# Altium schematic sheet Copy of Connectors.SchDoc: Connectors
size A3; Date: Not used; ApprovedBy: Not used; CheckedBy: Not used; Author: Not used; CompanyName: STMicroelectronics; DrawnBy: Not used; Engineer: Not used; Organization: Not used; Address1: Not used; Address2: Not used; Address3: Not used; Address4: Not used; DocumentNumber: 5; Revision: Not used; SheetNumber: 5; SheetTotal: 9; CurrentTime: Not used; CurrentDate: Not used; Time: Not used; DocumentFullPathAndName: Not used; DocumentName: Not used; ModifiedDate: Not used; ImagePath: Not used; ProjectName: Not used; Application_BuildNumber: Not used
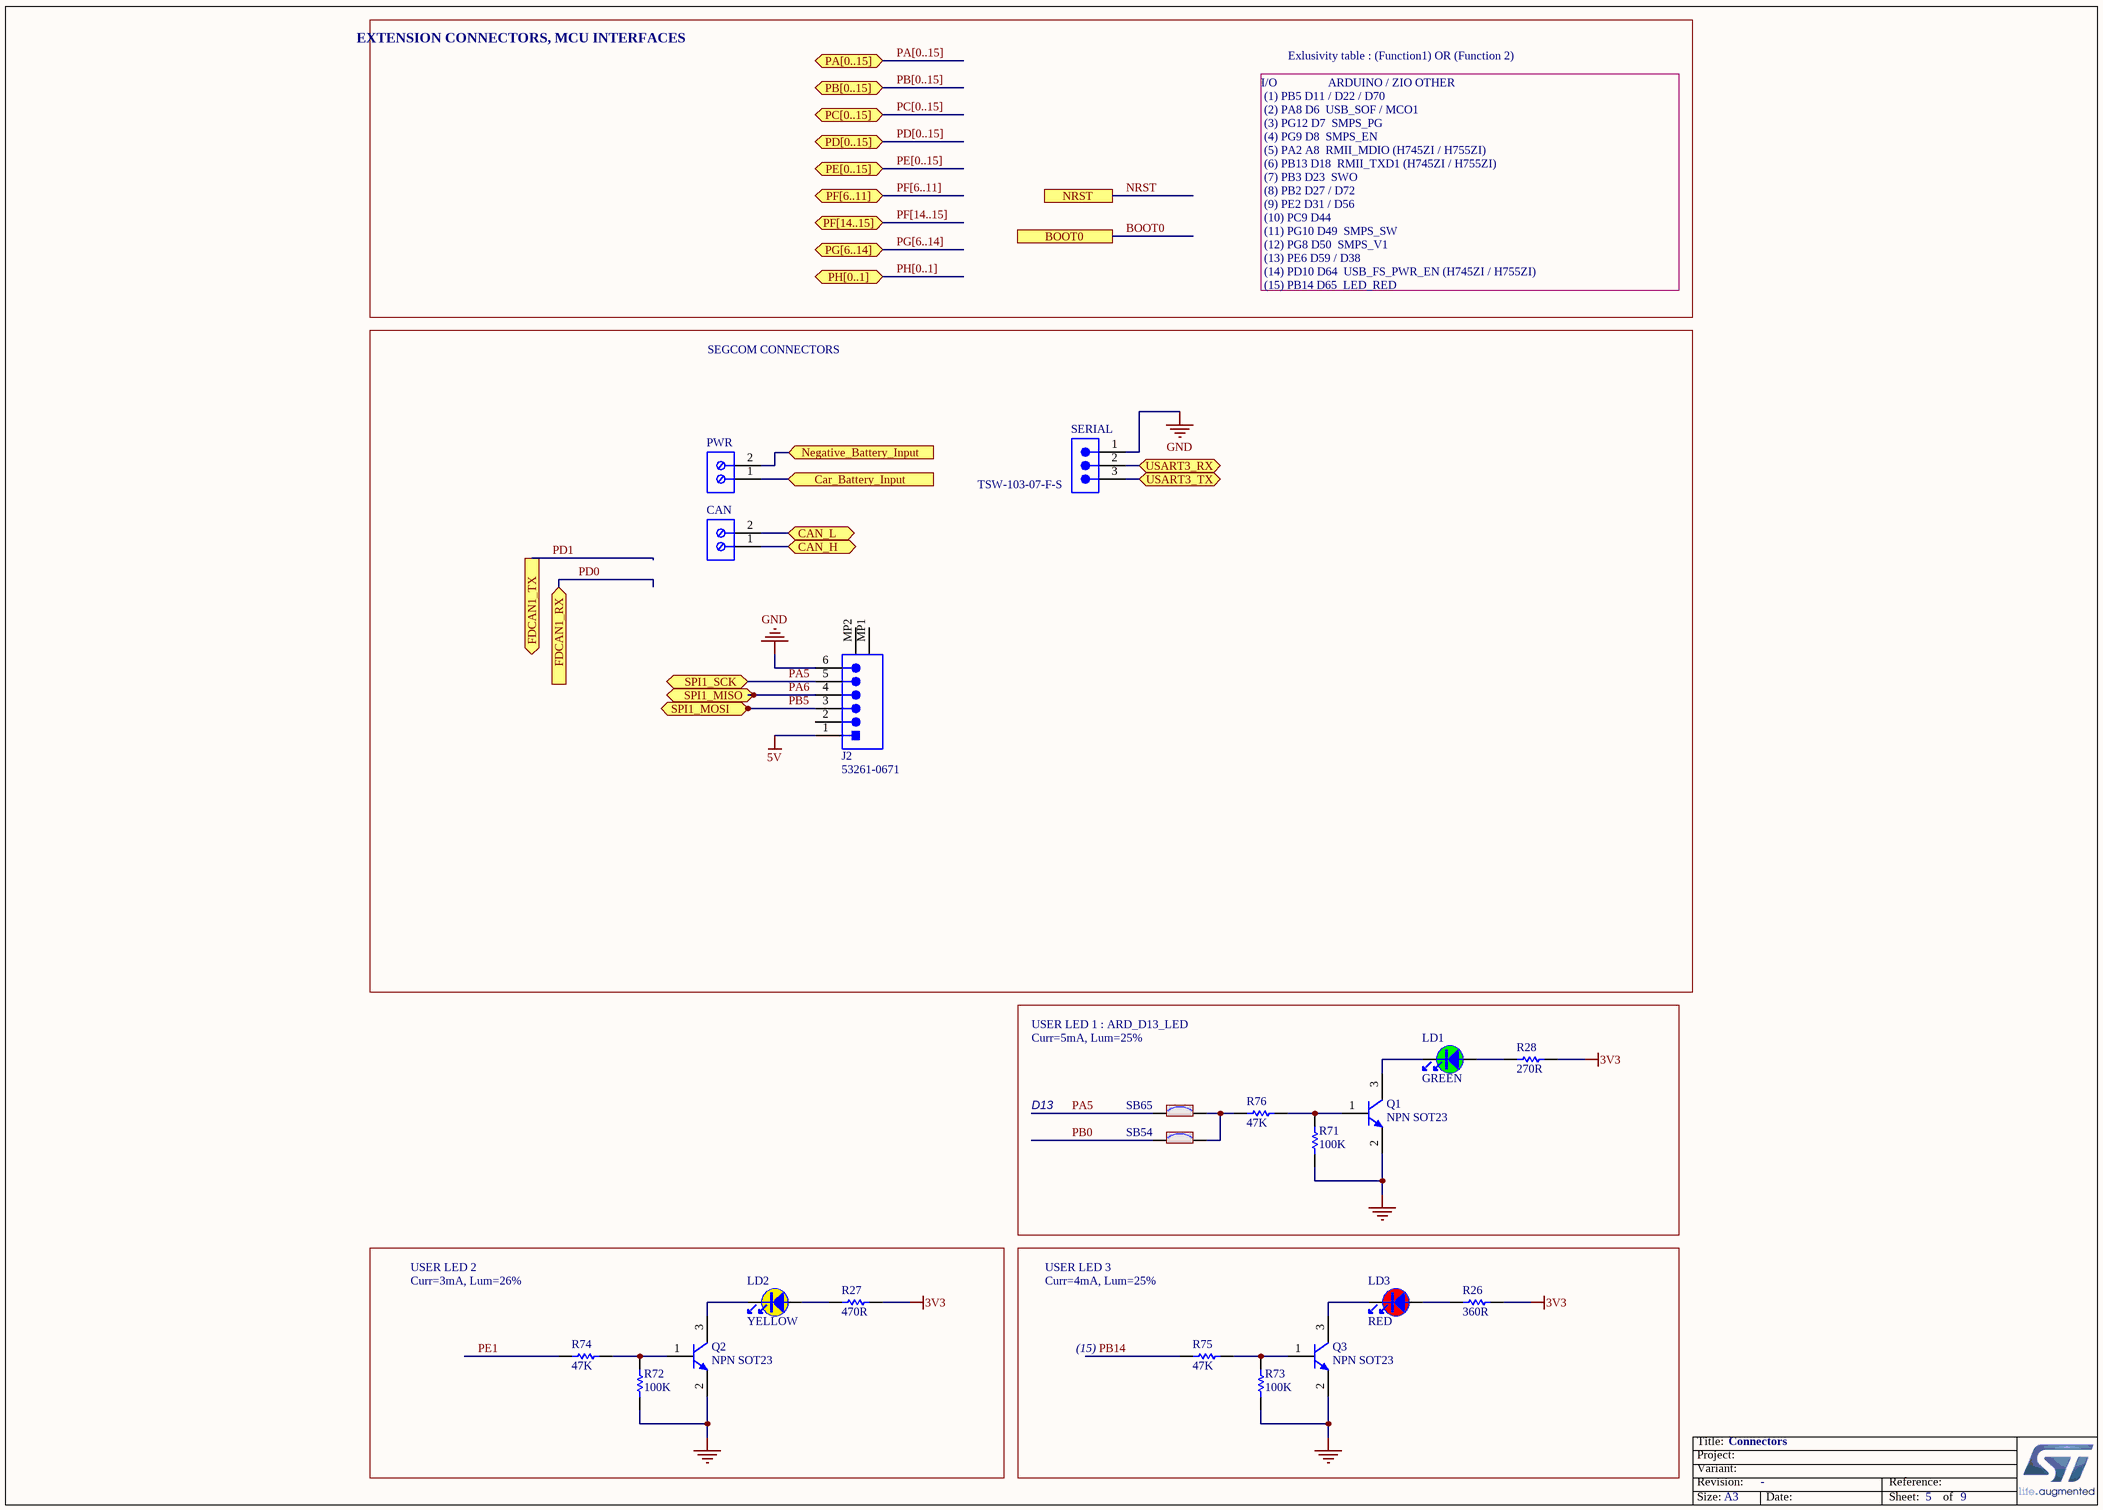
[diagram p0: Copy of Connectors.SchDoc]

## Parts
CAN  (no value)  [TECO-282836-2_V]
J2  53261-0671  [53261-0671]
LD1  value GREEN  [LED_0603_OSRAM_LG-Q396-PS-35_GREEN_1A2K_H0P4]  (hidden comment: LED_green)
LD2  value YELLOW  [LED_0603_OSRAM_LY-Q396-P1Q2-36_YELLOW_1A2K_H0P4]  (hidden comment: LED_yellow)
LD3  value RED  [LED_0603_OSRAM_LS-Q976-NR-1_RED_1A2K_H0P8]  (hidden comment: LED_red)
PWR  (no value)  [TECO-282836-2_V]
Q1  value NPN SOT23  [NPN_SOT23]  (hidden comment: 9013-SOT23)
Q2  value NPN SOT23  [NPN_SOT23]  (hidden comment: 9013-SOT23)
Q3  value NPN SOT23  [NPN_SOT23]  (hidden comment: 9013-SOT23)
R26  value 360R  [R0603]  (hidden comment: Resistor)
R27  value 470R  [R0603]  (hidden comment: Resistor)
R28  value 270R  [R0402]  (hidden comment: Resistor)
R71  value 100K  [R0603]  (hidden comment: Resistor)
R72  value 100K  [R0603]  (hidden comment: Resistor)
R73  value 100K  [R0603]  (hidden comment: Resistor)
R74  value 47K  [R0603]  (hidden comment: Resistor)
R75  value 47K  [R0603]  (hidden comment: Resistor)
R76  value 47K  [R0603]  (hidden comment: Resistor)
SB54  SB_ON  [SOLDER-BRIDGE_R0603-0R]  (value not drawn)
SB65  SB_ON  [SOLDER-BRIDGE_R0603-0R]  (value not drawn)
SERIAL  TSW-103-07-F-S  [SMTC-TSW-103-07-X-S]

## Blocks framed on the sheet
SEGCOM CONNECTORS: CAN J2 PWR SERIAL

## Ports
BOOT0, CAN_H (bidir), CAN_L (bidir), Car_Battery_Input (in), FDCAN1_RX (in), FDCAN1_TX (out), Negative_Battery_Input (in), NRST, PA[0..15] (bidir), PB[0..15] (bidir), PC[0..15] (bidir), PD[0..15] (bidir), PE[0..15] (bidir), PF[6..11] (bidir), PF[14..15] (bidir), PG[6..14] (bidir), PH[0..1] (bidir), SPI1_MISO (bidir), SPI1_MOSI (bidir), SPI1_SCK (bidir), USART3_RX (bidir), USART3_TX (bidir)

## Nets
3V3: R26.2 R27.2 R28.2
5V: J2.1
GND: J2.6 Q1.2(E) Q2.2(E) Q3.2(E) R71.1 R72.1 R73.1 SERIAL.1
BOOT0: port BOOT0
CAN_H: CAN.1 ; port CAN_H
CAN_L: CAN.2 ; port CAN_L
Car_Battery_Input: PWR.1 ; port Car_Battery_Input
Negative_Battery_Input: PWR.2 ; port Negative_Battery_Input
NRST: port NRST
PA5: J2.5 SB65.1 ; port SPI1_SCK
PA6: J2.4 ; port SPI1_MISO
PB0: SB54.1
PB5: J2.3 ; port SPI1_MOSI
PB14: R75.1
PD0: port FDCAN1_RX
PD1: port FDCAN1_TX
PE1: R74.1
USART3_RX: SERIAL.2 ; port USART3_RX
USART3_TX: SERIAL.3 ; port USART3_TX
NetLD1_1: LD1.1 R28.1
NetLD1_2: LD1.2 Q1.3(C)
NetLD2_1: LD2.1 R27.1
NetLD2_2: LD2.2 Q2.3(C)
NetLD3_1: LD3.1 R26.1
NetLD3_2: LD3.2 Q3.3(C)
NetQ1_1: Q1.1(B) R71.2 R76.2
NetQ2_1: Q2.1(B) R72.2 R74.2
NetQ3_1: Q3.1(B) R73.2 R75.2
NetR76_1: R76.1 SB54.2 SB65.2

Not connected (* = marked no-connect by the designer): J2 2 MP1 MP2

## Buses and harness runs
bus PA[0..15] = port PA[0..15]
bus PB[0..15] = port PB[0..15]
bus PC[0..15] = port PC[0..15]
bus PD[0..15] = port PD[0..15]
bus PE[0..15] = port PE[0..15]
bus PF[6..11] = port PF[6..11]
bus PF[14..15] = port PF[14..15]
bus PG[6..14] = port PG[6..14]
bus PH[0..1] = port PH[0..1]

## Notes on the sheet
- EXTENSION CONNECTORS, MCU INTERFACES
- Exlusivity table : (Function1) OR (Function 2)
- I/O	                ARDUINO / ZIO	OTHER
  (1)	PB5	D11 / D22 / D70
  (2)	PA8	D6		USB_SOF / MCO1
  (3)	PG12	D7		SMPS_PG
  (4)	PG9	D8		SMPS_EN
  (5)	PA2	A8		RMII_MDIO (H745ZI / H755ZI)
  (6)	PB13	D18		RMII_TXD1 (H745ZI / H755ZI)
  (7)	PB3	D23		SWO
  (8)	PB2	D27 / D72
  (9)	PE2	D31 / D56
  (10)	PC9	D44
  (11)	PG10	D49		SMPS_SW
  (12)	PG8	D50		SMPS_V1
  (13)	PE6	D59 / D38
  (14)	PD10	D64		USB_FS_PWR_EN (H745ZI / H755ZI)
  (15)	PB14	D65		LED_RED
- USER LED 1 : ARD_D13_LED
- Curr=5mA, Lum=25%
- D13
- USER LED 2
- Curr=3mA, Lum=26%
- USER LED 3
- Curr=4mA, Lum=25%
- (15)
- Title:
- Project:
- Size:
- Revision:
- Variant:
- A3
- -
- Date:
- Reference:
- Sheet:
- of

## Library data of the parts
CAN PWR = CMP-1684-00017-1: Female Header, Pitch 5 mm, 1 x 2 Position, Height 10 mm, Tail Length 3.5 mm, Rohs, Bulk; Manufacturer: TE Connectivity; Wire Gauge: 16-30AWG; Product Training Modules: Wire-to-BoardEurostyleTerminalBlocks; Clamp Material - Plating: Brass-NickelPlated; Voltage: 300V; Mating Orientation: HorizontalwithBoard; Current: 13.5A; Pitch: 0.197"(5.00mm); Screw Thread: M3; 3D Model: 282836-2.pdf; Other Names: 5ULV-02B / A98076; Dynamic Catalog: BuchananSeries; Number of Levels: 1; Torque - Screw: 0.68Nm(6Lb-In); Featured Product: EurostyleTerminalBlockConnectors; Positions Per Level: 2; Wire Termination: Screw-RisingCageClamp; Datasheet URL: http://www.te.com.cn/commerce/DocumentDelivery/DDEController?Action=showdoc&DocId=Catalog+Section%7F1308389_EUROSTYLE_TERMINAL_BLOCKS%7F0607%7Fpdf%7FEnglish%7FENG_CS_1308389_EUROSTYLE_TERMINAL_BLOCKS_0607.pdf%7F282836-2; Color: Green; Family: TerminalBlocks-WiretoBoard; RoHS Information: 282836-2StatementofCompliance; Standard Package: 300; Contact Material - Plating: Brass-TinPlated; Manufacturer URL: http://www.te.com; Housing Material: Polyamide(PA66),Nylon6/6; Features: Interlocking(Side); Package Description: Female Header, Pitch 5 mm, 1 x 2 Position, Height 10 mm, Tail Length 3.5 mm; Mounting Type: ThroughHole; Package Reference: THD; Packaging: Bulk; Series: Buchanan; Category: Connectors,Interconnects; Screw Material - Plating: Brass-NickelPlated
J2 = CMP-002-00079-1: 1.25mm (.049") Pitch PicoBlade Header, Surface Mount, Right Angle, Lead-free, 6 Circuits; Manufacturer Series: 53261; Manufacturer: Molex; Filter Feature: No; Number of Positions: 6; Voltage Rating (DC): 125V; Body Plating: Tin; Number of Rows Loaded: 1; Gender: Male; Glow Wire Compliant: Non-compliant; Insulation Resistance: 100MR; Current Rating: 1A; Option: General Purpose; ComponentLink6Description: https://datasheet.ciiva.com/9468/0532610671-pcb-headers-9468508.pdf?src-supplier=Avnet; Number of Circuits: 6; Termination: SMD/SMT; Source: Board.SCHLIB; Number of Contacts: 6; ComponentLink3URL: https://datasheet.ciiva.com/11746/0900766b8078fc7f-11746609.pdf?src-supplier=Rs; Pricing 1: 1=0,58, 10=0,502, 50=0,502, 100=0,467, 1000=0,437, 10000=0,375 (USD); RoHS: Yes; Lead Free: Lead Free; Max Operating Temperature: 85°C; Design Item ID: 53261-0671; ComponentLink7URL: https://datasheet.ciiva.com/14156/gh116861-116874-e-14156230.pdf?src-supplier=Distrelec; Reach SVHC Compliant: Unknown; ComponentLink5URL: https://datasheet.ciiva.com/34302/1302107-34302178.pdf?src-supplier=Jameco; Flammability Rating: UL94 V-0; Plating: Tin; Pitch: 1.25mm; Contact Material: Bronze,Brass,Tin; ComponentLink2Description: https://datasheet.ciiva.com/30206/347800532610671-pcb-headers-30206472.pdf?src-supplier=Onlinecomponents.com; Voltage Rating: 125V; Mixed Contacts: No; Working Voltage: 125V; ComponentLink4URL: https://datasheet.ciiva.com/22703/1839670-22703170.pdf?src-supplier=Element14; ComponentLink1URL: https://datasheet.ciiva.com/5153/0532610671-pcb-headers-170915-5153227.pdf?src-supplier=Mouser; Category: Headers and Wire Housings; ComponentLink5Description: https://datasheet.ciiva.com/34302/1302107-34302178.pdf?src-supplier=Jameco; Manufacturer Part Number: 53261-0671; Color: Beige; Voltage Rating (AC): 125V; Lead Pitch: 1.25mm; DIN Conformance: No; Number of Rows: 1; Package Quantity: 1000; ComponentLink7Description: https://datasheet.ciiva.com/14156/gh116861-116874-e-14156230.pdf?src-supplier=Distrelec; Series: PicoBlade; RoHS Compliant: Yes; Mounting Style: STRAIGHT; Contact Plating: Tin; Min Operating Temperature: -40°C; Orientation: Right Angle; Packaging: Tape and Reel; ComponentLink2URL: https://datasheet.ciiva.com/30206/347800532610671-pcb-headers-30206472.pdf?src-supplier=Onlinecomponents.com; Mounting Technology: Board; ComponentLink3Description: https://datasheet.ciiva.com/11746/0900766b8078fc7f-11746609.pdf?src-supplier=Rs; ComponentLink4Description: https://datasheet.ciiva.com/22703/1839670-22703170.pdf?src-supplier=Element14; Stock 1: 44828; Contact Gender: Male; ComponentLink6URL: https://datasheet.ciiva.com/9468/0532610671-pcb-headers-9468508.pdf?src-supplier=Avnet; IEC Conformance: No; ComponentLink1Description: https://datasheet.ciiva.com/5153/0532610671-pcb-headers-170915-5153227.pdf?src-supplier=Mouser; Housing Material: Thermoplastic; Radiation Hardening: No; MIL Conformance: No
LD1 = MCD-00588: LED Green, 0603 SMD, Forward Voltage Typ=2V, Max=2.5V; Part_Type: Display; Manufacturer_Part_Number: LG Q396-PS-35; Manufacturer: OSRAM OPTO SEMICONDUCTORS; Alternate_Manufacturer_Part_Number: VLMTG1300-GS08; Alternate_Manufacturer: VISHAY SEMICONDUCTOR OPTO DIVISION; Provided_By: SUBCO; Internal_Part_Number: MCD-00588; Status: Released; Package: LED 0603; ComponentLink1Description: Datasheet; ComponentLink1URL: http://tunmcdsvn.tun.st.com/Component_Datasheet_Library/Trunk/Display/OSRAM_LED_GREEN_LG Q396-PS-35; Order_Code_Digikey: LG Q396-PS-35-ND; ECCN_US: n/a; ECCN_EU: n/a
LD2 = MCD-01061: LED Yellow, 0603 SMD, Forward Voltage min=1.7V, Typ=2V, Max=2.3V; Part_Type: Display; Manufacturer_Part_Number: LY Q396-P1Q2-36; Manufacturer: OSRAM OPTO SEMICONDUCTORS; Provided_By: SUBCO; Internal_Part_Number: MCD-01061; Status: Released; ComponentLink1Description: Datasheet; ComponentLink1URL: http://tunmcdsvn.tun.st.com/Component_Datasheet_Library/Trunk/Display/OSRAM_LED_0603_YELLOW_LY Q396-P1Q2-36; ECCN_US: n/a; ECCN_EU: n/a
LD3 = MCD-00586: LED Red, 0603 SMD, Forward Voltage Typ=2V, Max=2.5V; Part_Type: Display; Manufacturer_Part_Number: LS Q976-NR-1; Manufacturer: OSRAM OPTO SEMICONDUCTORS; Alternate_Manufacturer_Part_Number: VLMS1300-GS08; Alternate_Manufacturer: VISHAY SEMICONDUCTOR OPTO DIVISION; Provided_By: SUBCO; Internal_Part_Number: MCD-00586; Status: Released; Package: LED 0603; ComponentLink1Description: Datasheet; ComponentLink1URL: http://tunmcdsvn.tun.st.com/Component_Datasheet_Library/Trunk/Display/OSRAM_LED_RED_LS Q976-NR-1; Order_Code_Digikey: 475-2512-1-ND; ECCN_US: n/a; ECCN_EU: n/a
Q1-Q3 = MCD-00073: NPN Bipolar Transistor; Part_Type: IC; Manufacturer_Part_Number: BSR14; Manufacturer: ON SEMICONDUCTOR; Alternate_Manufacturer_Part_Number: MMBT2222LT1G / MMBT2222ALT1G / MMBT2222ALT3G; Provided_By: SUBCO; ECCN_US: EAR99; ECCN_EU: NEC; Revision: *; Internal_Part_Number: MCD-00073; Status: Released; ComponentLink1Description: Datasheet; ComponentLink1URL: http://tunmcdsvn.tun.st.com/Component_Datasheet_Library/Trunk/IC/NXP_Transistor_BSR14; Alternate_Manufacturer: ON SEMICONDUCTOR; Package: SOT23
R26 = MCD-00462: Resistor,360R,0603,1%,1/10W; Manufacturer_Part_Number: RC0603FR-07360RL; Manufacturer: YAGEO; BMS_Part_Number: 9129744; Provided_By: SUBCO; ECCN_US: EAR99; ECCN_EU: NEC; Internal_Part_Number: MCD-00462; Status: Released; Part_Type: Resistor; Package: R0603; ComponentLink1Description: Datasheet; ComponentLink1URL: http://tunmcdsvn.tun.st.com/Component_Datasheet_Library/Trunk/Resistors/Yageo_Resistor_RC0603-series
R27 = MCD-00354: Resistor,470R,0603,1%,1/10W; Manufacturer_Part_Number: RC0603FR-07470RL; Manufacturer: YAGEO; BMS_Part_Number: 9129906; Provided_By: SUBCO; ECCN_US: EAR99; ECCN_EU: NEC; Internal_Part_Number: MCD-00354; Status: Released; Part_Type: Resistor; Package: R0603; ComponentLink1Description: Datasheet; ComponentLink1URL: http://tunmcdsvn.tun.st.com/Component_Datasheet_Library/Trunk/Resistors/Yageo_Resistor_RC0603-series
R28 = MCD-00441: Resistor,270R,0402,1%,1/16W; Manufacturer_Part_Number: RC0402FR-07270RL; Manufacturer: YAGEO; Provided_By: SUBCO; ECCN_US: EAR99; ECCN_EU: NEC; Internal_Part_Number: MCD-00441; Status: Released; Part_Type: Resistor; Package: R0402; ComponentLink1Description: Datasheet; ComponentLink1URL: http://tunmcdsvn.tun.st.com/Component_Datasheet_Library/Trunk/Resistors/Yageo_Resistor_RC0402-series
R71-R73 = MCD-00223: Resistor,100K,0603,1%,1/10W; Manufacturer_Part_Number: RC0603FR-07100KL; Manufacturer: YAGEO; Provided_By: SUBCO; ECCN_US: EAR99; ECCN_EU: NEC; Internal_Part_Number: MCD-00223; Status: Released; Part_Type: Resistor; ComponentLink1Description: Datasheet; Package: R0603; ComponentLink1URL: http://tunmcdsvn.tun.st.com/Component_Datasheet_Library/Trunk/Resistors/Yageo_Resistor_RC0603-series
R74-R76 = MCD-00222: Resistor,47K,0603,1%,1/10W; Manufacturer_Part_Number: RC0603FR-0747KL; Manufacturer: YAGEO; Provided_By: SUBCO; ECCN_US: EAR99; ECCN_EU: NEC; Internal_Part_Number: MCD-00222; Status: Released; Part_Type: Resistor; ComponentLink1Description: Datasheet; Package: R0603; ComponentLink1URL: http://tunmcdsvn.tun.st.com/Component_Datasheet_Library/Trunk/Resistors/Yageo_Resistor_RC0603-series
SB54 SB65 = MCD-00071: Solder Bridge ON; Part_Type: Mechanical; Manufacturer_Part_Number: RC0603JR-070RL; Manufacturer: YAGEO; Provided_By: SUBCO; Internal_Part_Number: MCD-00071; Status: Released; ComponentLink1Description: Datasheet; Package: SB0603; ComponentLink1URL: http://tunmcdsvn.tun.st.com/Component_Datasheet_Library/Trunk/Resistors/Yageo_Resistor_RC0603-series; ECCN_US: n/a; ECCN_EU: n/a
SERIAL = CMP-1024-00331-1: 0.025" SQ Post Header, Through-hole, Vertical, -55 to 125 degC, 2.54 mm Pitch, 3-Pin, Male, RoHS; Manufacturer: Samtec; Pitch: 2.54 mm; DatasheetVersion: F-214; ComponentLink1Description: Manufacturer URL; ComponentLink3URL: http://www.samtec.com/documents/webfiles/cpdf/TSW-XXX-XX-XXX-X-XX-XXX-MKT.pdf; Mounting Technology: Through-hole; PackageDescription: .025[0.64] SQ. Post Terminal Strip Assembly; Temperature Range: -55 to 125 degC; ComponentLink3Description: Package Specification; Orientation: Vertical; PartNumber: TSW-103-07-F-S; RoHS: True; PackageVersion: DM, 8/1988; ComponentLink2Description: Datasheet; ComponentLink1URL: http://www.samtec.com; ComponentLink2URL: http://www.samtec.com/documents/webfiles/pdf/TSW_TH.PDF; PackageReference: TSW-103-07-X-S